# EAGLE schematic LED VCF (EAGLE 6.6.0)
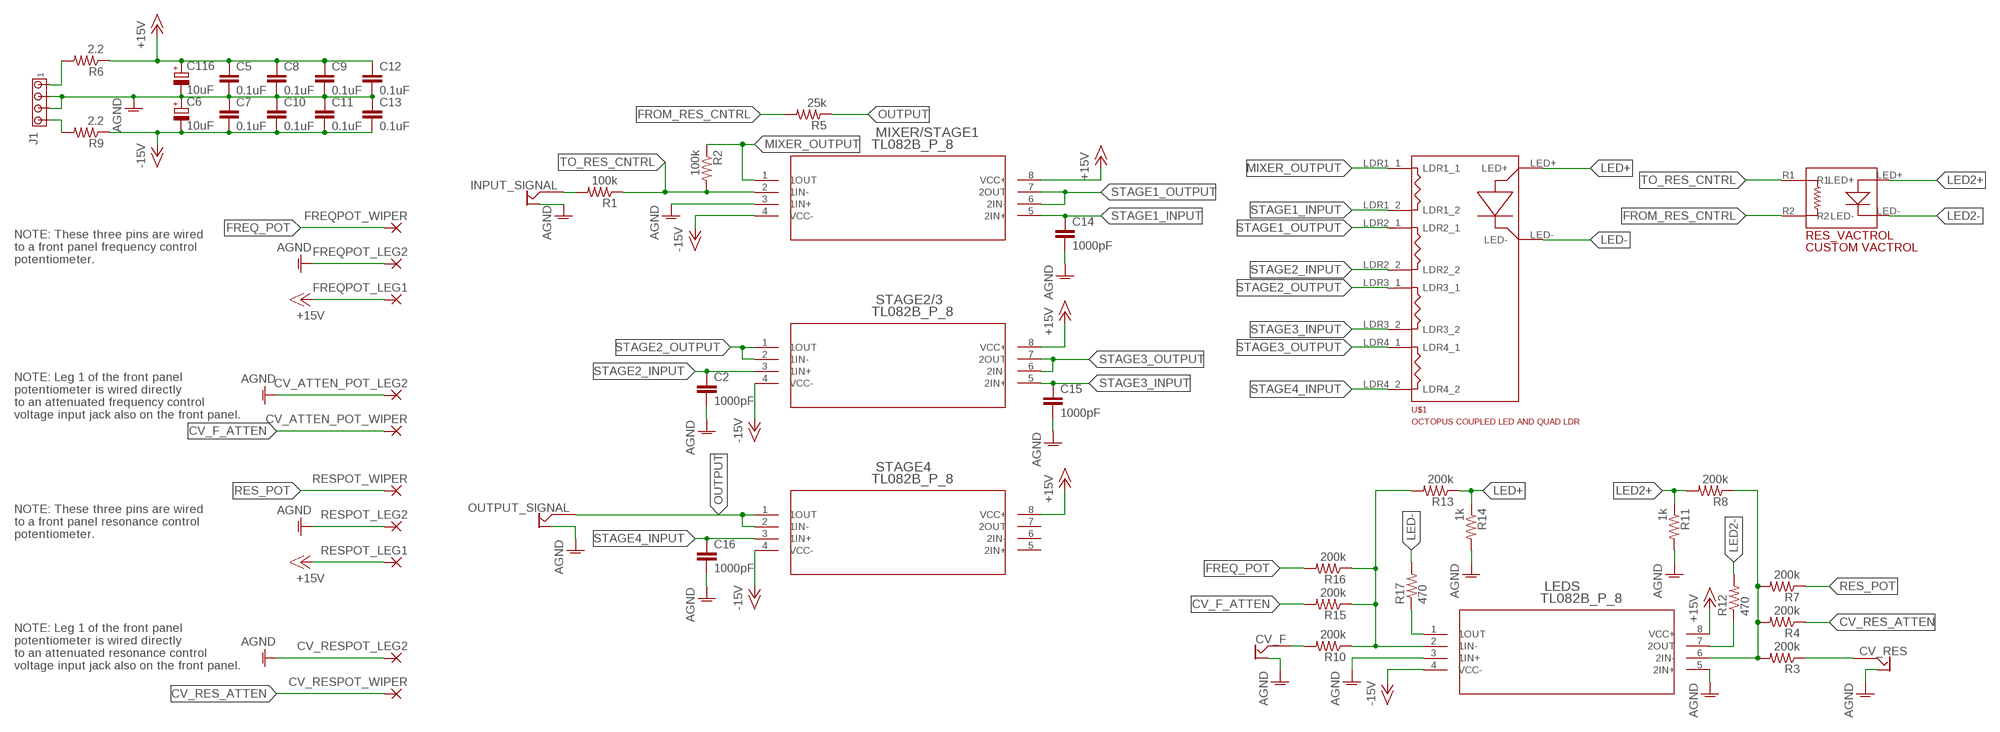
[diagram p0: schematic, sheet 1]

## Parts
C2  1000pF  CAP_  [AXIAL-5MM]
C5  0.1uF  CAP_  [AXIAL-5MM]
C6  10uF  CPOL-EUE1.8-4  [E1,8-4]
C7  0.1uF  CAP_  [AXIAL-5MM]
C8  0.1uF  CAP_  [AXIAL-5MM]
C9  0.1uF  CAP_  [AXIAL-5MM]
C10  0.1uF  CAP_  [AXIAL-5MM]
C11  0.1uF  CAP_  [AXIAL-5MM]
C12  0.1uF  CAP_  [AXIAL-5MM]
C13  0.1uF  CAP_  [AXIAL-5MM]
C14  1000pF  CAP_  [AXIAL-5MM]
C15  1000pF  CAP_  [AXIAL-5MM]
C16  1000pF  CAP_  [AXIAL-5MM]
C116  10uF  CPOL-EUE1.8-4  [E1,8-4]
CV_ATTEN_POT_LEG2  IOPAD  [ELLIPTICALPADSINGLE]
CV_ATTEN_POT_WIPER  IOPAD  [ELLIPTICALPADSINGLE]
CV_F  OFFBOARD2JACK  [OFFBOARD2JACK]
CV_RES  OFFBOARD2JACK  [OFFBOARD2JACK]
CV_RESPOT_LEG2  IOPAD  [ELLIPTICALPADSINGLE]
CV_RESPOT_WIPER  IOPAD  [ELLIPTICALPADSINGLE]
FREQPOT_LEG1  IOPAD  [ELLIPTICALPADSINGLE]
FREQPOT_LEG2  IOPAD  [ELLIPTICALPADSINGLE]
FREQPOT_WIPER  IOPAD  [ELLIPTICALPADSINGLE]
INPUT_SIGNAL  OFFBOARD2JACK  [OFFBOARD2JACK]
J1  MTA04-156  [1X4MTA]
LEDS  TL082B_P_8  [P8]
MIXER/STAGE1  TL082B_P_8  [P8]
OUTPUT_SIGNAL  OFFBOARD2JACK  [OFFBOARD2JACK]
R1  100k  RESISTORPTH-1/4W  [AXIAL-0.4]
R2  100k  RESISTORPTH-1/4W  [AXIAL-0.4]
R3  200k  RESISTORPTH-1/4W  [AXIAL-0.4]
R4  200k  RESISTORPTH-1/4W  [AXIAL-0.4]
R5  25k  RESISTORPTH-1/4W  [AXIAL-0.4]
R6  2.2  RESISTORPTH-1/4W  [AXIAL-0.4]
R7  200k  RESISTORPTH-1/4W  [AXIAL-0.4]
R8  200k  RESISTORPTH-1/4W  [AXIAL-0.4]
R9  2.2  RESISTORPTH-1/4W  [AXIAL-0.4]
R10  200k  RESISTORPTH-1/4W  [AXIAL-0.4]
R11  1k  RESISTORPTH-1/4W  [AXIAL-0.4]
R12  470  RESISTORPTH-1/4W  [AXIAL-0.4]
R13  200k  RESISTORPTH-1/4W  [AXIAL-0.4]
R14  1k  RESISTORPTH-1/4W  [AXIAL-0.4]
R15  200k  RESISTORPTH-1/4W  [AXIAL-0.4]
R16  200k  RESISTORPTH-1/4W  [AXIAL-0.4]
R17  470  RESISTORPTH-1/4W  [AXIAL-0.4]
RES_VACTROL  CUSTOM_VACTROL_HAYDENTHROUGH-HOLE  [CUSTOM_VACTROL_HAYDEN]
RESPOT_LEG1  IOPAD  [ELLIPTICALPADSINGLE]
RESPOT_LEG2  IOPAD  [ELLIPTICALPADSINGLE]
RESPOT_WIPER  IOPAD  [ELLIPTICALPADSINGLE]
STAGE2/3  TL082B_P_8  [P8]
STAGE4  TL082B_P_8  [P8]
U$1  OCTOPUS_LED_QUAD_LDRTHROUGH_HOLE  [OCTOPUS_LED_QUAD_LDR]

## Nets
+15V: C5.P$1 C8.P$1 C9.P$1 C12.P$1 C116.+ FREQPOT_LEG1.P$1(P) LEDS.8(VCC+) MIXER/STAGE1.8(VCC+) R6.P$1 RESPOT_LEG1.P$1(P) STAGE2/3.8(VCC+) STAGE4.8(VCC+)
-15V: C6.- C7.P$2 C10.P$2 C11.P$2 C13.P$2 LEDS.4(VCC-) MIXER/STAGE1.4(VCC-) R9.P$1 STAGE2/3.4(VCC-) STAGE4.4(VCC-)
AGND: C2.P$2 C5.P$2 C6.+ C7.P$1 C8.P$2 C9.P$2 C10.P$1 C11.P$1 C12.P$2 C13.P$1 C14.P$2 C15.P$2 C16.P$2 C116.- CV_ATTEN_POT_LEG2.P$1(P) CV_F.GND CV_RES.GND CV_RESPOT_LEG2.P$1(P) FREQPOT_LEG2.P$1(P) INPUT_SIGNAL.GND J1.2 J1.3 LEDS.3(1IN+) LEDS.5(2IN+) MIXER/STAGE1.3(1IN+) OUTPUT_SIGNAL.GND R11.P$2 R14.P$2 RESPOT_LEG2.P$1(P)
CV_F_ATTEN: CV_ATTEN_POT_WIPER.P$1(P) R15.P$2
CV_RES_ATTEN: CV_RESPOT_WIPER.P$1(P) R4.P$1
FREQ_POT: FREQPOT_WIPER.P$1(P) R16.P$2
FROM_RES_CNTRL: R5.P$2 RES_VACTROL.R2
LED2+: R8.P$2 R11.P$1 RES_VACTROL.LED+
LED2-: R12.P$2 RES_VACTROL.LED-
LED+: R13.P$1 R14.P$1 U$1.LED+
LED-: R17.P$2 U$1.LED-
MIXER_OUTPUT: MIXER/STAGE1.1(1OUT) R2.P$1 U$1.LDR1_1
N$1: CV_RES.SIGNAL R3.P$1
N$2: LEDS.6(2IN-) R3.P$2 R4.P$2 R7.P$2 R8.P$1
N$3: J1.1 R6.P$2
N$4: INPUT_SIGNAL.SIGNAL R1.P$2
N$5: J1.4 R9.P$2
N$6: LEDS.2(1IN-) R10.P$1 R13.P$2 R15.P$1 R16.P$1
N$7: CV_F.SIGNAL R10.P$2
N$8: LEDS.1(1OUT) R17.P$1
N$9: LEDS.7(2OUT) R12.P$1
OUTPUT: OUTPUT_SIGNAL.SIGNAL R5.P$1 STAGE4.1(1OUT) STAGE4.2(1IN-)
RES_POT: R7.P$1 RESPOT_WIPER.P$1(P)
STAGE1_INPUT: C14.P$1 MIXER/STAGE1.5(2IN+) U$1.LDR1_2
STAGE1_OUTPUT: MIXER/STAGE1.6(2IN-) MIXER/STAGE1.7(2OUT) U$1.LDR2_1
STAGE2_INPUT: C2.P$1 STAGE2/3.3(1IN+) U$1.LDR2_2
STAGE2_OUTPUT: STAGE2/3.1(1OUT) STAGE2/3.2(1IN-) U$1.LDR3_1
STAGE3_INPUT: C15.P$1 STAGE2/3.5(2IN+) U$1.LDR3_2
STAGE3_OUTPUT: STAGE2/3.6(2IN-) STAGE2/3.7(2OUT) U$1.LDR4_1
STAGE4_INPUT: C16.P$1 STAGE4.3(1IN+) U$1.LDR4_2
TO_RES_CNTRL: MIXER/STAGE1.2(1IN-) R1.P$1 R2.P$2 RES_VACTROL.R1
Unconnected: STAGE4.5(2IN+) STAGE4.6(2IN-) STAGE4.7(2OUT)

## Notes on the sheet
- NOTE: These three pins are wired 
  to a front panel frequency control 
  potentiometer.
- NOTE: Leg 1 of the front panel
  potentiometer is wired directly 
  to an attenuated frequency control 
  voltage input jack also on the front panel.
- NOTE: These three pins are wired 
  to a front panel resonance control 
  potentiometer.
- NOTE: Leg 1 of the front panel
  potentiometer is wired directly 
  to an attenuated resonance control 
  voltage input jack also on the front panel.

## Library data of the parts
C2 C5 C7-C16 = SparkFun-Passives:CAP: Capacitor Standard 0603 ceramic capacitor, and 0.1" leaded capacitor.
C6 C116 = rcl:CPOL-EU: POLARIZED CAPACITOR, European symbol
CV_ATTEN_POT_LEG2 CV_ATTEN_POT_WIPER CV_RESPOT_LEG2 CV_RESPOT_WIPER FREQPOT_LEG1 FREQPOT_LEG2 FREQPOT_WIPER RESPOT_LEG1 RESPOT_LEG2 RESPOT_WIPER = aarons_library:IOPAD
CV_F CV_RES INPUT_SIGNAL OUTPUT_SIGNAL = aarons_library:OFFBOARD2JACK
J1 = con-amp:MTA04-156: AMP connector
LEDS MIXER/STAGE1 STAGE2/3 STAGE4 = TL082_TI:TL082B_P_8; DATASHEETURL: http://www.ti.com/lit/gpn/TL082B; DESCRIPTION: JFET-Input Operational Amplifier; FAMILY_NAME: STANDARD LINEAR AMPLIFIER; GENERIC_PART_NUMBER: TL082B; INDUSTRY_STD_PKG_TYPE: PDIP; MANUFACTURER: Texas Instruments; MANUFACTURER_PART_NUMBER: tl082b_p_8; PACKAGE_DESIGNATOR: P; PIN_COUNT: 8; VENDOR: Texas Instruments
R1-R17 = SparkFun-Passives:RESISTOR: Resistor Basic schematic elements and footprints for 0603, 1206, and PTH resistors.
RES_VACTROL = Vactrol_Hayden_Custom:CUSTOM_VACTROL_HAYDEN
U$1 = Octopus_Coupled_LED_Quad_LDR:OCTOPUS_LED_QUAD_LDR